# EAGLE design QuadcopterRobocet (EAGLE 6.6.0)
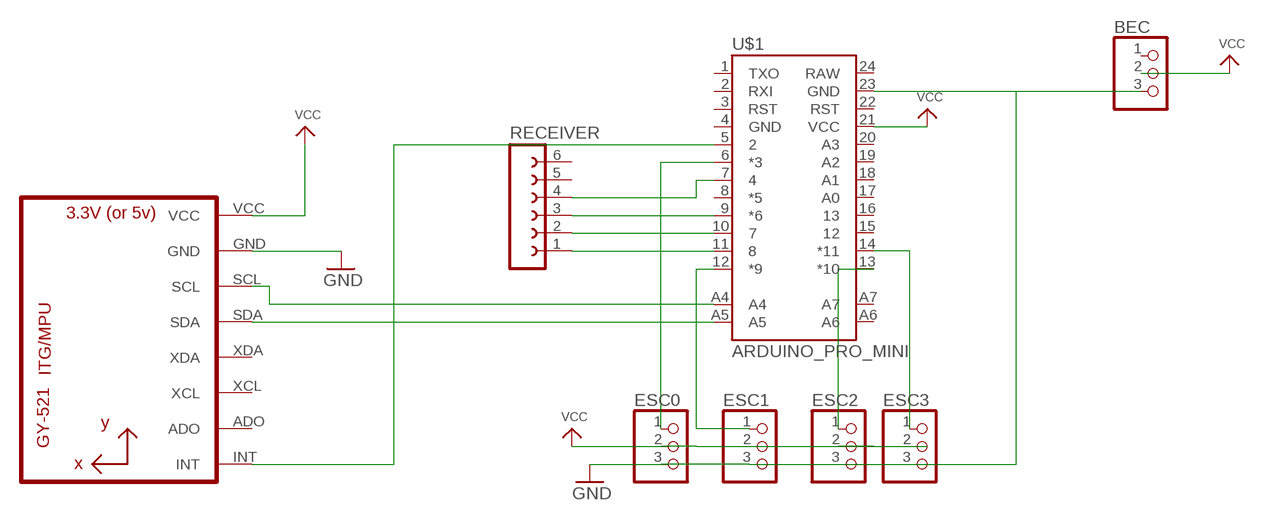
[diagram p0: schematic, sheet 1]

## Parts
BEC  PINHD-1X3  [1X03]
ESC0  PINHD-1X3  [1X03]
ESC1  PINHD-1X3  [1X03]
ESC2  PINHD-1X3  [1X03]
ESC3  PINHD-1X3  [1X03]
RECEIVER  FE06-1  [FE06]
U1  GY-521MPU6050  [GY-521]
U$1  ARDUINO_PRO_MINI  [ARDUINO_PRO_MINI]

## Nets
GND: BEC.3 ESC0.3 ESC1.3 ESC2.3 ESC3.3 U1.GND U$1.23(GND)
N$1: U1.SCL U$1.A4
N$2: U1.SDA U$1.A5
N$3: U1.INT U$1.5
N$6: RECEIVER.1 U$1.11
N$7: RECEIVER.2 U$1.10
N$8: RECEIVER.3 U$1.9(*6)
N$9: RECEIVER.4 U$1.7
N$10: ESC0.1 U$1.6(*3)
N$11: ESC1.1 U$1.12(*9)
N$12: ESC2.1 U$1.13(*10)
N$13: ESC3.1 U$1.14(*11)
VCC: BEC.2 ESC0.2 ESC1.2 ESC2.2 ESC3.2 U1.VCC U$1.21(VCC)
Unconnected: BEC.1 RECEIVER.5 RECEIVER.6 U1.ADO U1.XCL U1.XDA U$1.1(TXO) U$1.2(RXI) U$1.3(RST) U$1.4(GND) U$1.8(*5) U$1.15 U$1.16 U$1.17(A0) U$1.18(A1) U$1.19(A2) U$1.20(A3) U$1.22(RST) U$1.24(RAW) U$1.A6 U$1.A7

## Library data of the parts
BEC ESC0 ESC1-ESC3 = adafruit:PINHD-1X3: PIN HEADER
RECEIVER = con-lsta:FE06-1: FEMALE HEADER; OC_FARNELL: unknown; OC_NEWARK: unknown
U1 = gy-521:GY-521
U$1 = SparkFun-Boards:ARDUINO_PRO_MINI

## Board
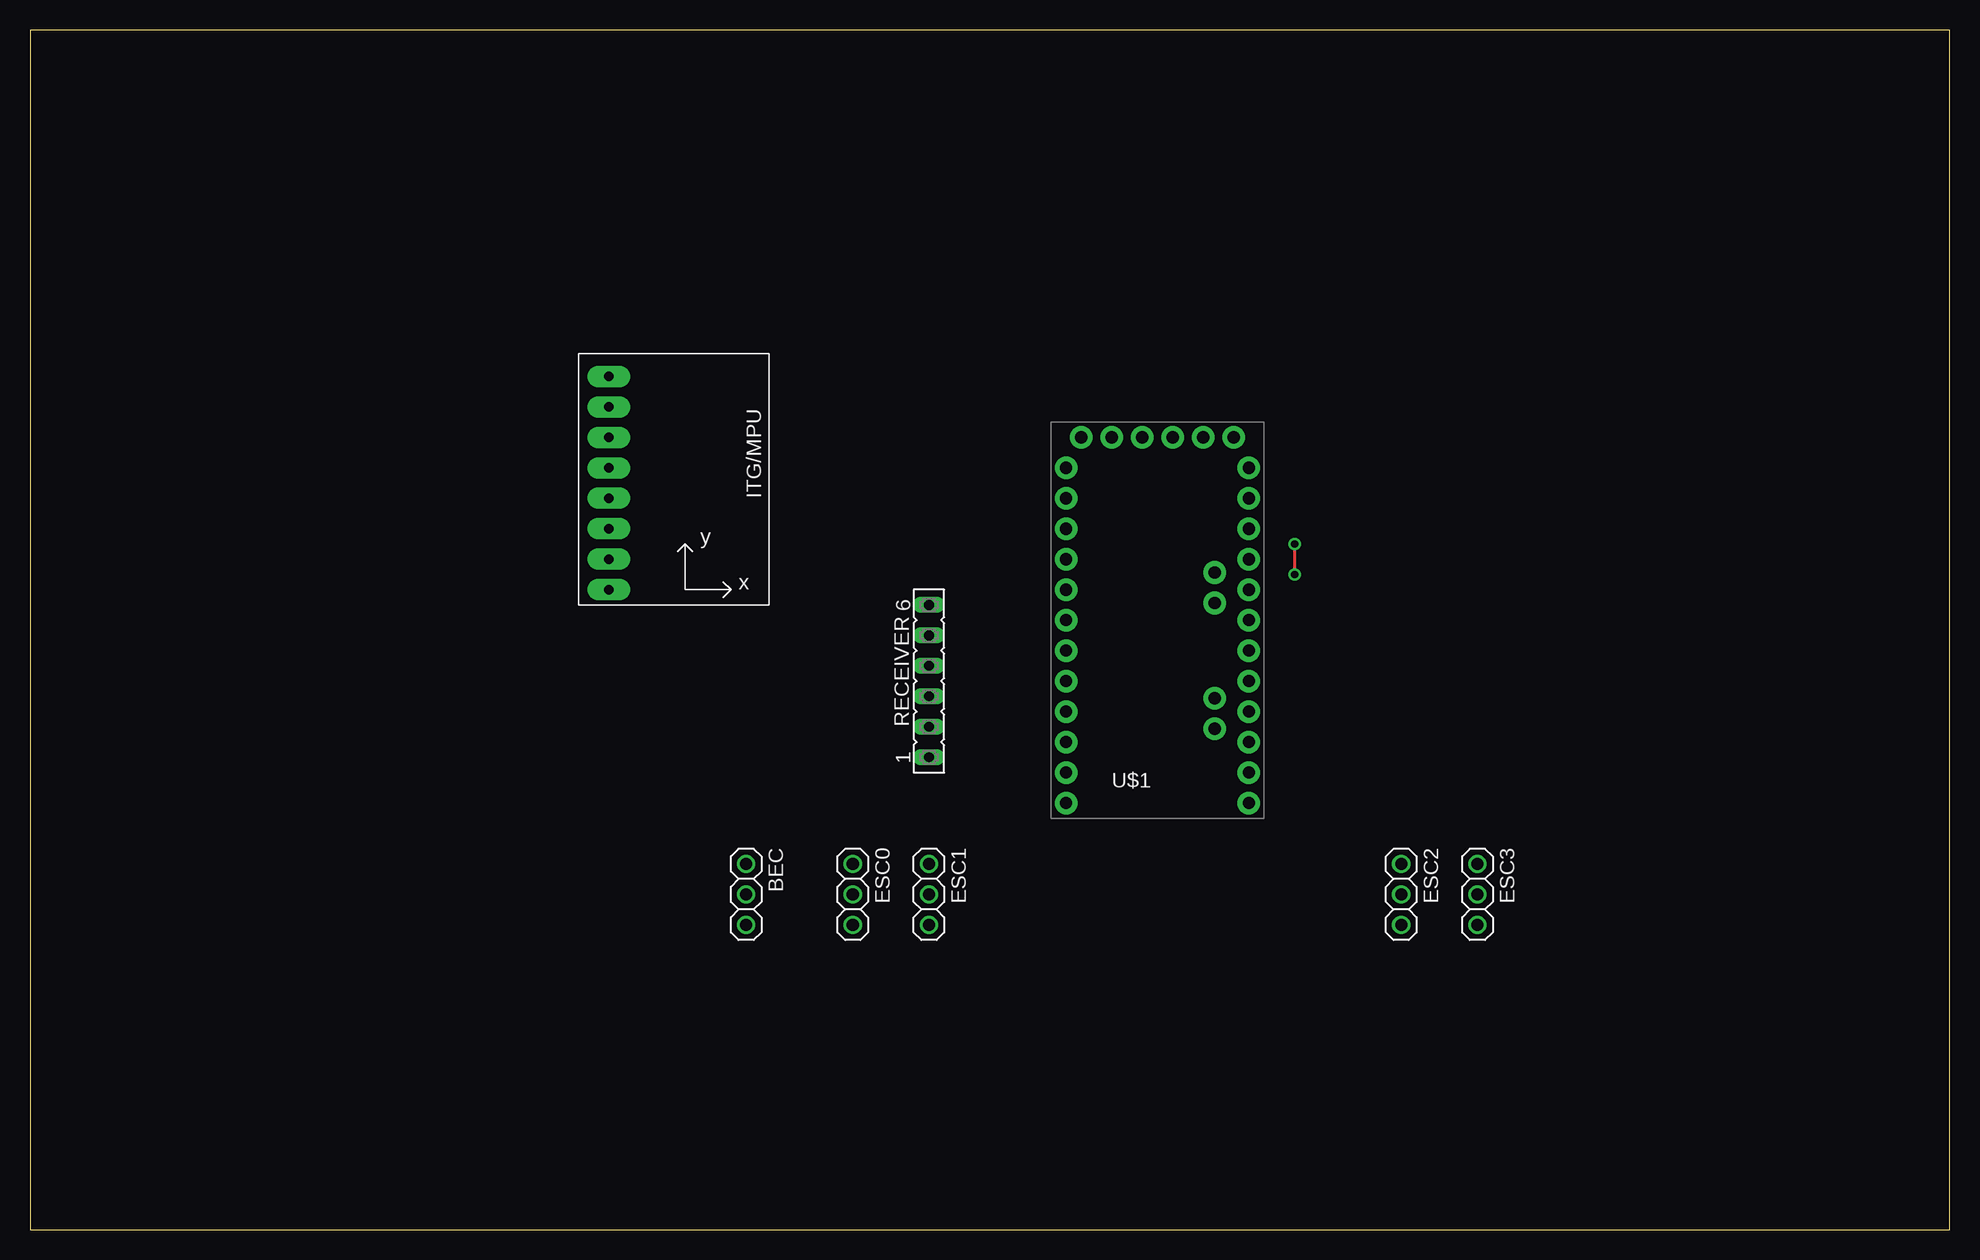
[diagram p1: board, top side]
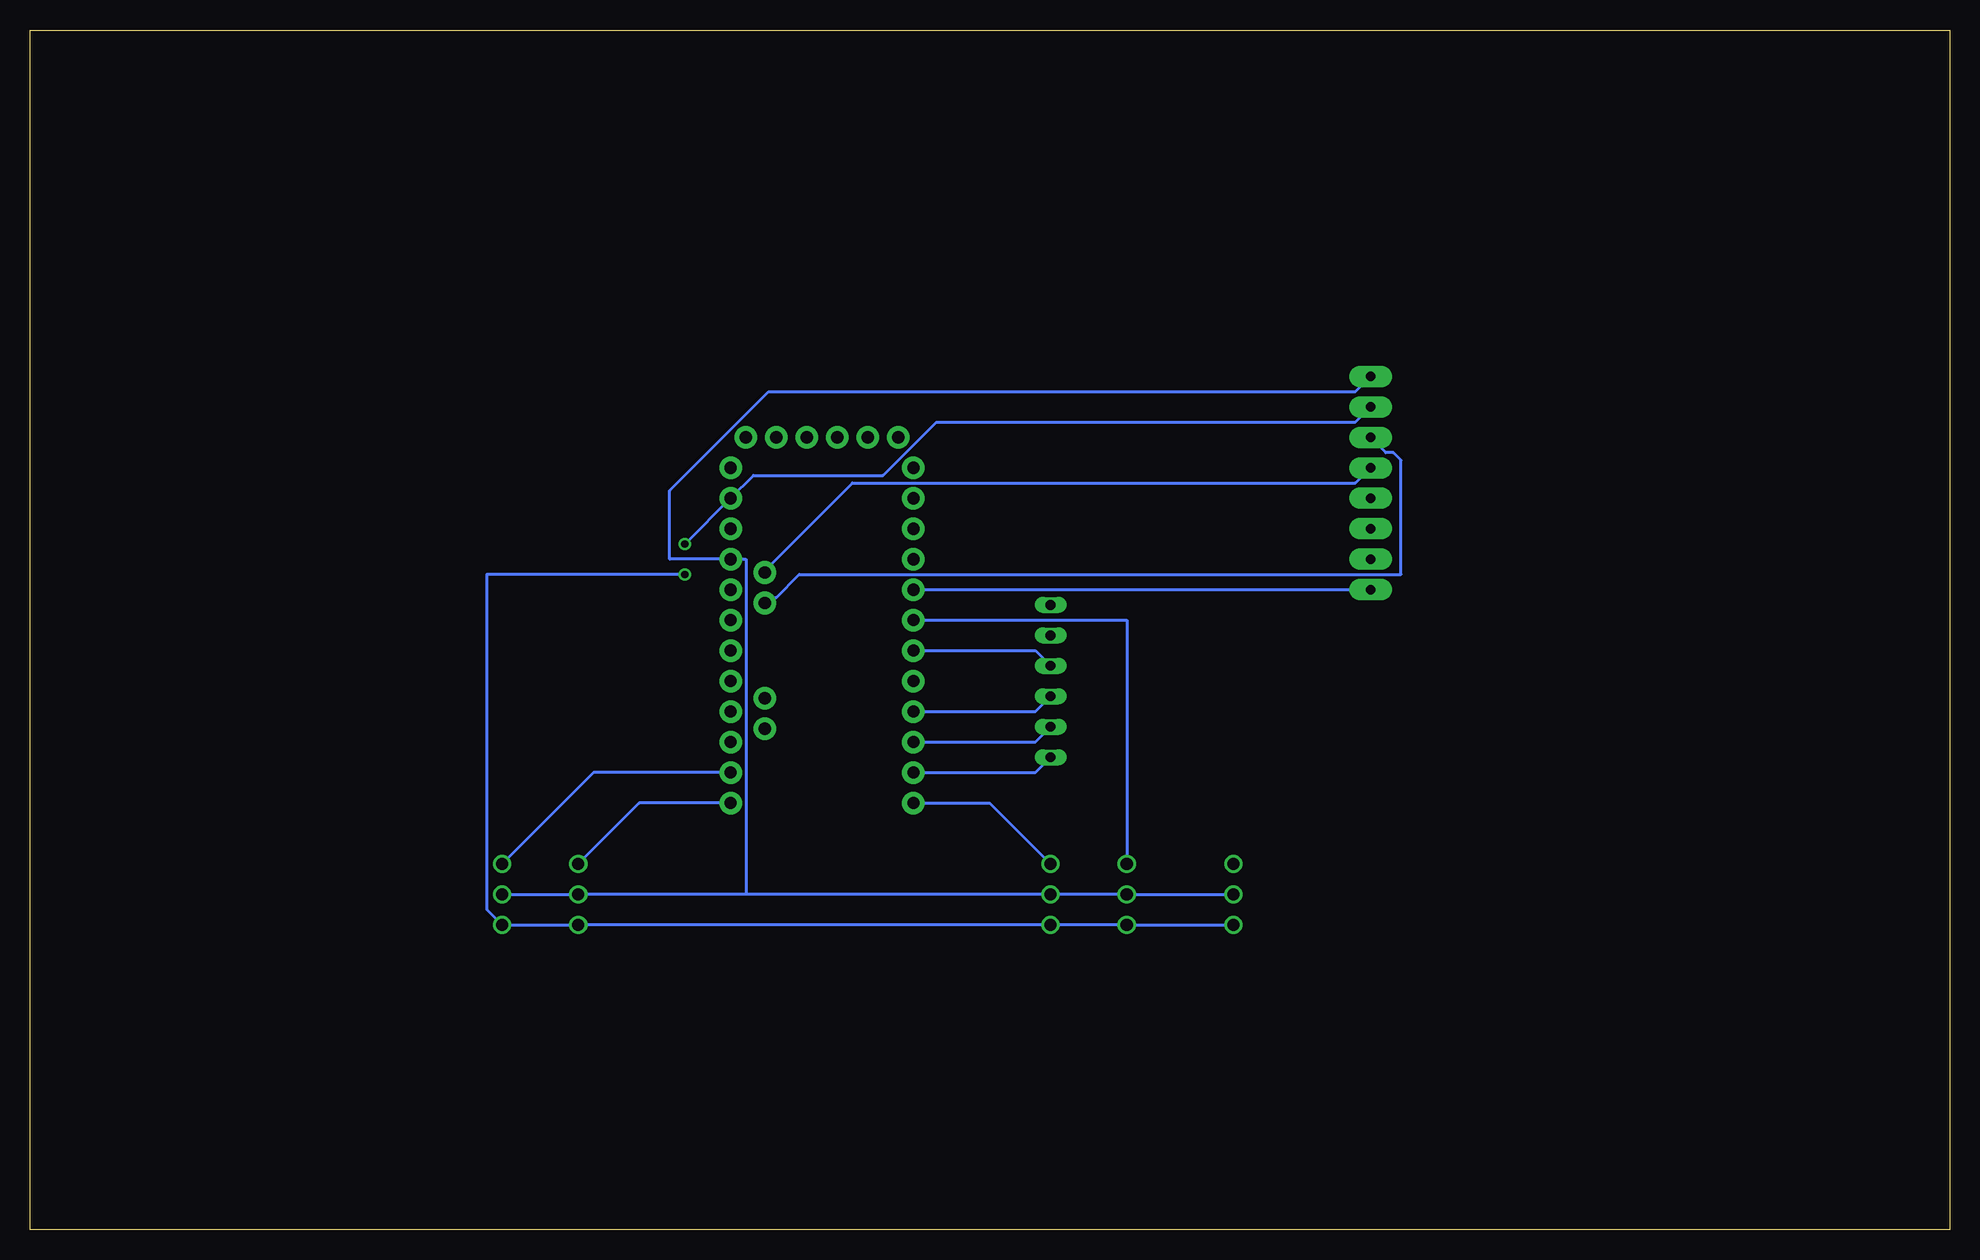
[diagram p2: board, bottom side, seen from below]

Size 160 x 100 mm. Coordinates in mm from the lower left corner, seen from the top.
Outline: 0,0 160,0 160,100 0,100 0,0
Copper layers (1*16): Top 0.035mm / dielectric 1.5mm / Bottom 0.035mm
Design rules "default": minimum track width 10mil, minimum drill 24mil, track to track 8mil, track to pad 8mil, pad to pad 8mil, via to via 8mil, smd to smd 8mil, copper to edge 40mil, drill to drill 8mil, minimum pad ring 10mil, minimum via ring 8mil, stop-mask expansion 4mil, vias tented up to drill 0mil, thermal gap 10mil

### Footprints (pad centres in the part's own frame; a part is rotated, then mirrored left to right if it is on the bottom)
1X03 = drill 1.016: 1 -2.54,0; 2 0,0; 3 2.54,0
FE06 = drill 0.813 long: 1 -6.35,0; 2 -3.81,0; 3 -1.27,0; 4 1.27,0; 5 3.81,0; 6 6.35,0
GY-521 = drill 0.8 pad 1.778 long: ADO -8.89,-6.35; GND -8.89,6.35; INT -8.89,-8.89; SCL -8.89,3.81; SDA -8.89,1.27; VCC -8.89,8.89; XCL -8.89,-3.81; XDA -8.89,-1.27
ARDUINO_PRO_MINI = drill 1.016 pad 1.88: 1 -7.62,12.7; 2 -7.62,10.16; 3 -7.62,7.62; 4 -7.62,5.08; 5 -7.62,2.54; 6 -7.62,0; 7 -7.62,-2.54; 8 -7.62,-5.08; 9 -7.62,-7.62; 10 -7.62,-10.16; 11 -7.62,-12.7; 12 -7.62,-15.24; 13 7.62,-15.24; 14 7.62,-12.7; 15 7.62,-10.16; 16 7.62,-7.62; 17 7.62,-5.08; 18 7.62,-2.54; 19 7.62,0; 20 7.62,2.54; 21 7.62,5.08; 22 7.62,7.62; 23 7.62,10.16; 24 7.62,12.7; A4 4.763,1.429; A5 4.763,3.969; A6 4.763,-9.049; A7 4.763,-6.509; BLK -6.35,15.24; GND -3.81,15.24; GRN 6.35,15.24; RXI 1.27,15.24; TXO 3.81,15.24; VCC -1.27,15.24

### Placement (x,y rotation side)
BEC  59.69,27.94 270 top
ESC0  68.58,27.94 270 top
ESC1  74.93,27.94 270 top
ESC2  114.3,27.94 270 top
ESC3  120.65,27.94 270 top
RECEIVER  74.93,45.72 90 top
U1  57.15,62.23 0 top
U$1  93.98,50.8 0 top

### Tracks (layer width: path | path; a pad name or v marks a point on that pad's centre or on a via)
GND  (via drill 0.61)
  Top 0.254: v105.41,57.15 v105.41,54.61
  Bottom 0.254: BEC.3 ESC0.3 ESC1.3 ESC2.3 ESC3.3 121.92,26.67 121.92,54.61 v105.41,54.61 | U1.GND 49.53,67.31 84.45,67.31 88.9,62.87 99.69,62.87 U$1.23 v105.41,57.15
N$1
  Bottom 0.254: U1.SCL 46.99,64.77 46.35,64.77 45.72,64.14 45.72,54.61 95.89,54.61 97.79,52.7 98.42,52.7 U$1.A4
N$2
  Bottom 0.254: U1.SDA 49.53,62.23 91.44,62.23 98.42,55.24 U$1.A5
N$3
  Bottom 0.254: U$1.5 U1.INT
N$6
  Bottom 0.254: RECEIVER.1 76.2,38.1 U$1.11
N$7
  Bottom 0.254: RECEIVER.2 76.2,40.64 U$1.10
N$8
  Bottom 0.254: RECEIVER.3 76.2,43.18 U$1.9
N$9
  Bottom 0.254: RECEIVER.4 76.2,48.26 U$1.7
N$10
  Bottom 0.254: ESC0.1 68.58,50.8 U$1.6
N$11
  Bottom 0.254: ESC1.1 80.01,35.56 U$1.12
N$12
  Bottom 0.254: ESC2.1 109.22,35.56 U$1.13
N$13
  Bottom 0.254: ESC3.1 113.03,38.1 U$1.14
VCC
  Bottom 0.254: ESC3.2 ESC2.2 100.33,27.94 | BEC.2 ESC0.2 ESC1.2 100.33,27.94 | U1.VCC 49.53,69.85 98.42,69.85 106.68,61.59 106.68,55.88 U$1.21 100.33,55.88 100.33,27.94